# EAGLE design Tape IF frontend (EAGLE 6.5.0)
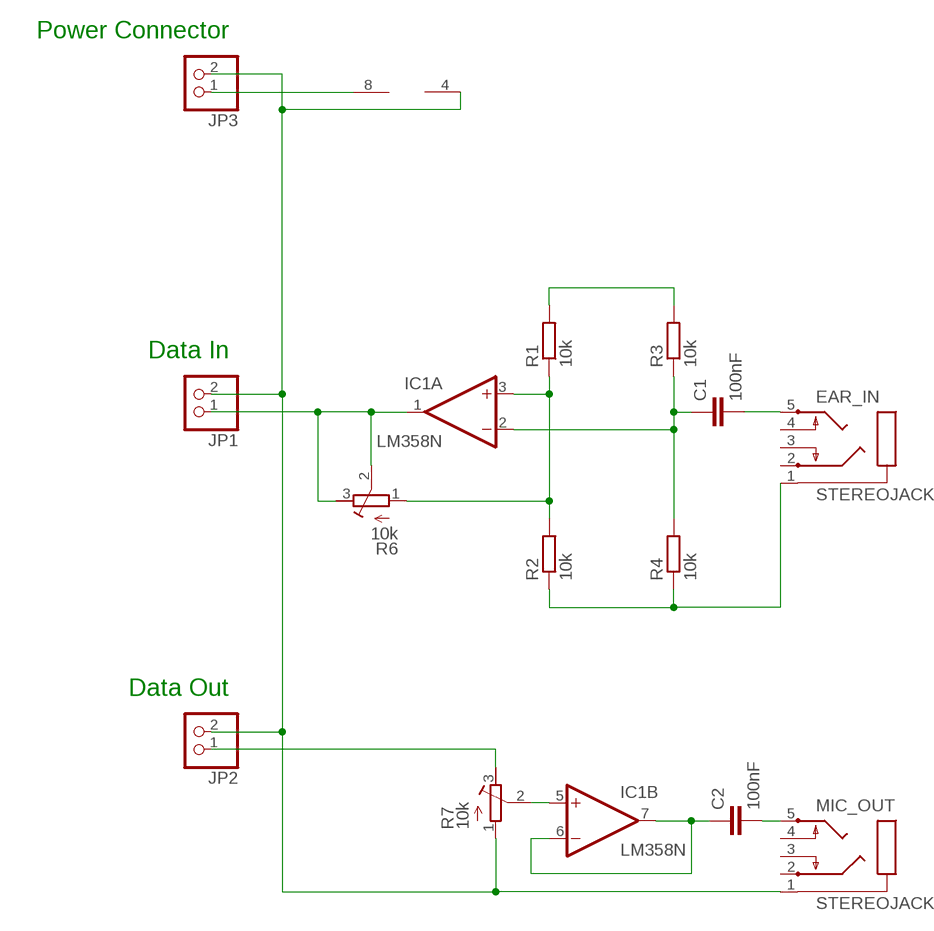
[diagram p0: schematic, sheet 1]

## Parts
C1  100nF  C-EU050-025X075  [C050-025X075]
C2  100nF  C-EU050-025X075  [C050-025X075]
EAR_IN  STEREOJACK  [STX3100]
IC1  LM358N  [DIL08]
JP1  PINHD-1X2  [1X02]
JP2  PINHD-1X2  [1X02]
JP3  PINHD-1X2  [1X02]
MIC_OUT  STEREOJACK  [STX3100]
R1  10k  R-EU_0207/10  [0207/10]
R2  10k  R-EU_0207/10  [0207/10]
R3  10k  R-EU_0207/10  [0207/10]
R4  10k  R-EU_0207/10  [0207/10]
R6  10k  R-TRIMM64W  [RTRIM64W]
R7  10k  R-TRIMM64W  [RTRIM64W]

## Nets
+5V: IC1.8(P:V+) JP3.1
BUFFERED_OUT: C2.2 MIC_OUT.5
EAR_SCHMITTED: IC1.1(A:OUT) JP1.1 R6.2(S) R6.3(E)
GND: IC1.4(P:V-) JP1.2 JP2.2 JP3.2 MIC_OUT.1 R7.1(A)
N$1: C1.2 EAR_IN.5
N$2: C1.1 IC1.2(A:-IN) R3.1 R4.2
N$3: IC1.3(A:+IN) R1.1 R2.2 R6.1(A)
N$4: EAR_IN.1 R2.1 R4.1
N$5: R1.2 R3.2
N$8: C2.1 IC1.6(B:-IN) IC1.7(B:OUT)
N$9: IC1.5(B:+IN) R7.2(S)
UNBUFFERED_OUT: JP2.1 R7.3(E)
Unconnected: EAR_IN.2 EAR_IN.3 EAR_IN.4 MIC_OUT.2 MIC_OUT.3 MIC_OUT.4

## Notes on the sheet
- Power Connector
- Data In
- Data Out

## Library data of the parts
C1 C2 = rcl:C-EU: CAPACITOR, European symbol
EAR_IN MIC_OUT = adafruit:STEREOJACK: MIC/HEADPHONE JACK Stereo jack with two switches. Kycon STX3100, CUI SJ1-3555NG and/or 4UCon 05544
IC1 = linear:LM358: OP AMP also LM158; LM258; LM2904 Source: http://cache.national.com/ds/LM/LM158.pdf
JP1-JP3 = pinhead:PINHD-1X2: PIN HEADER
R1-R4 = rcl:R-EU_: RESISTOR, European symbol
R6 R7 = rcl:R-TRIMM: Trimm resistor

## Board
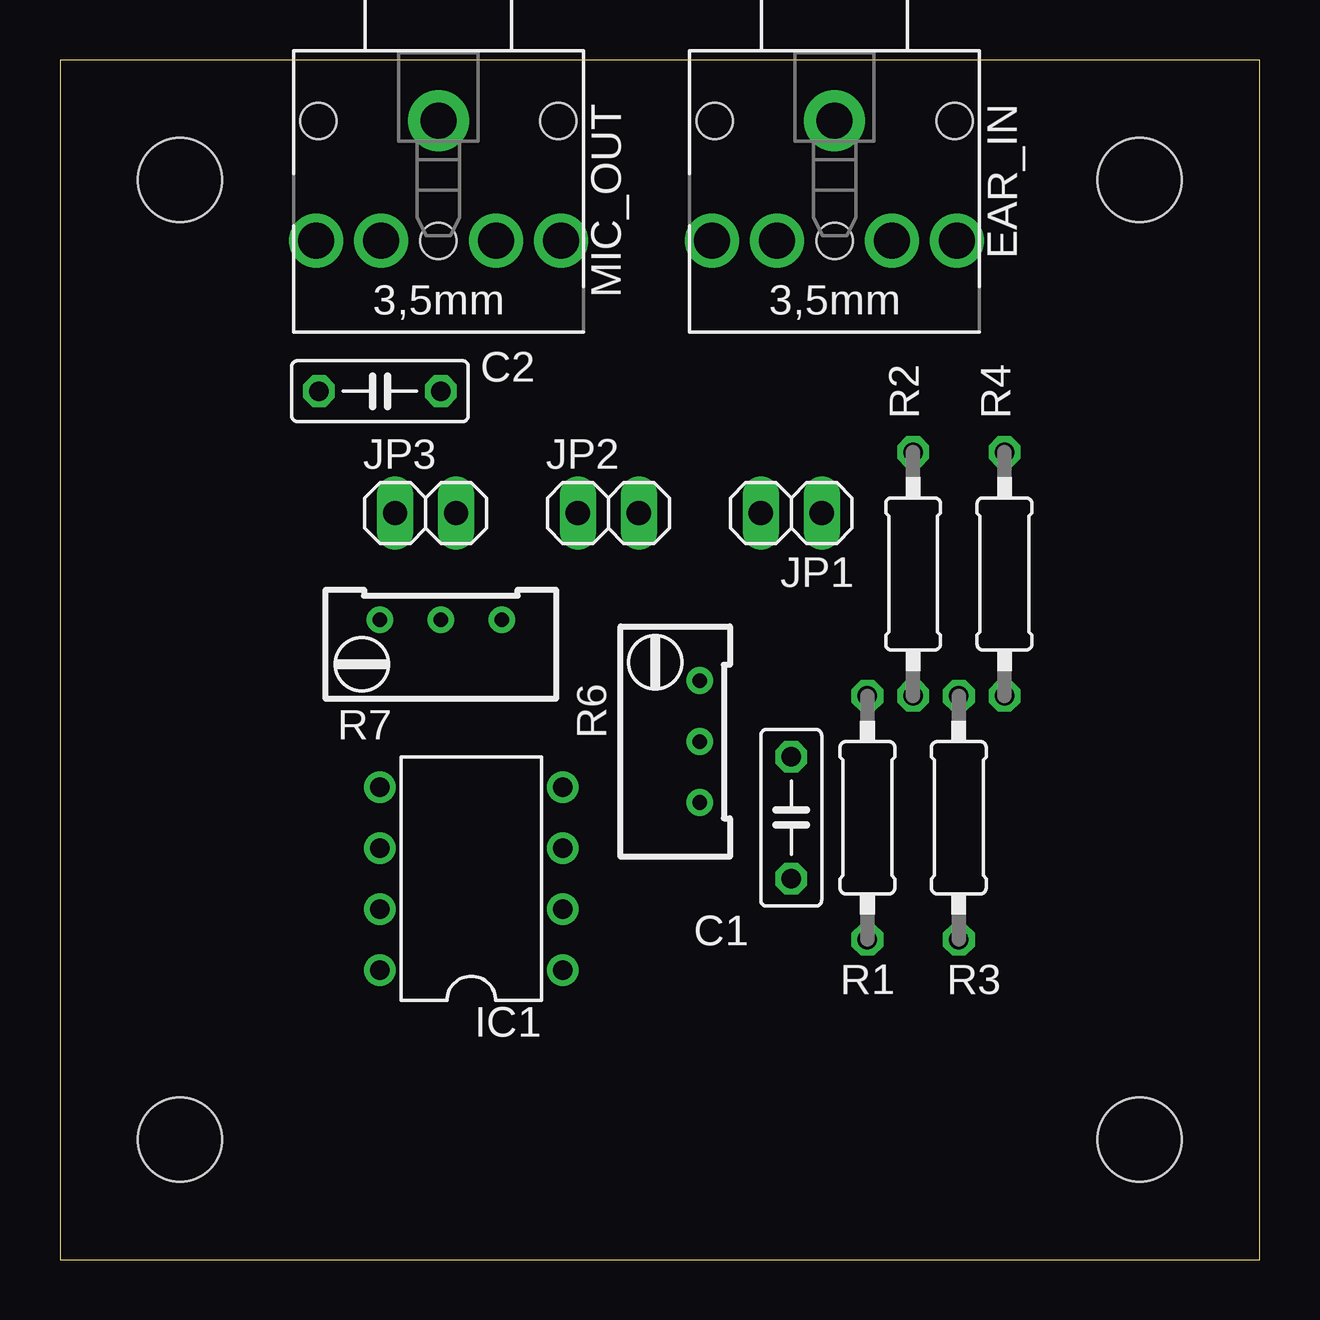
[diagram p1: board, top side]
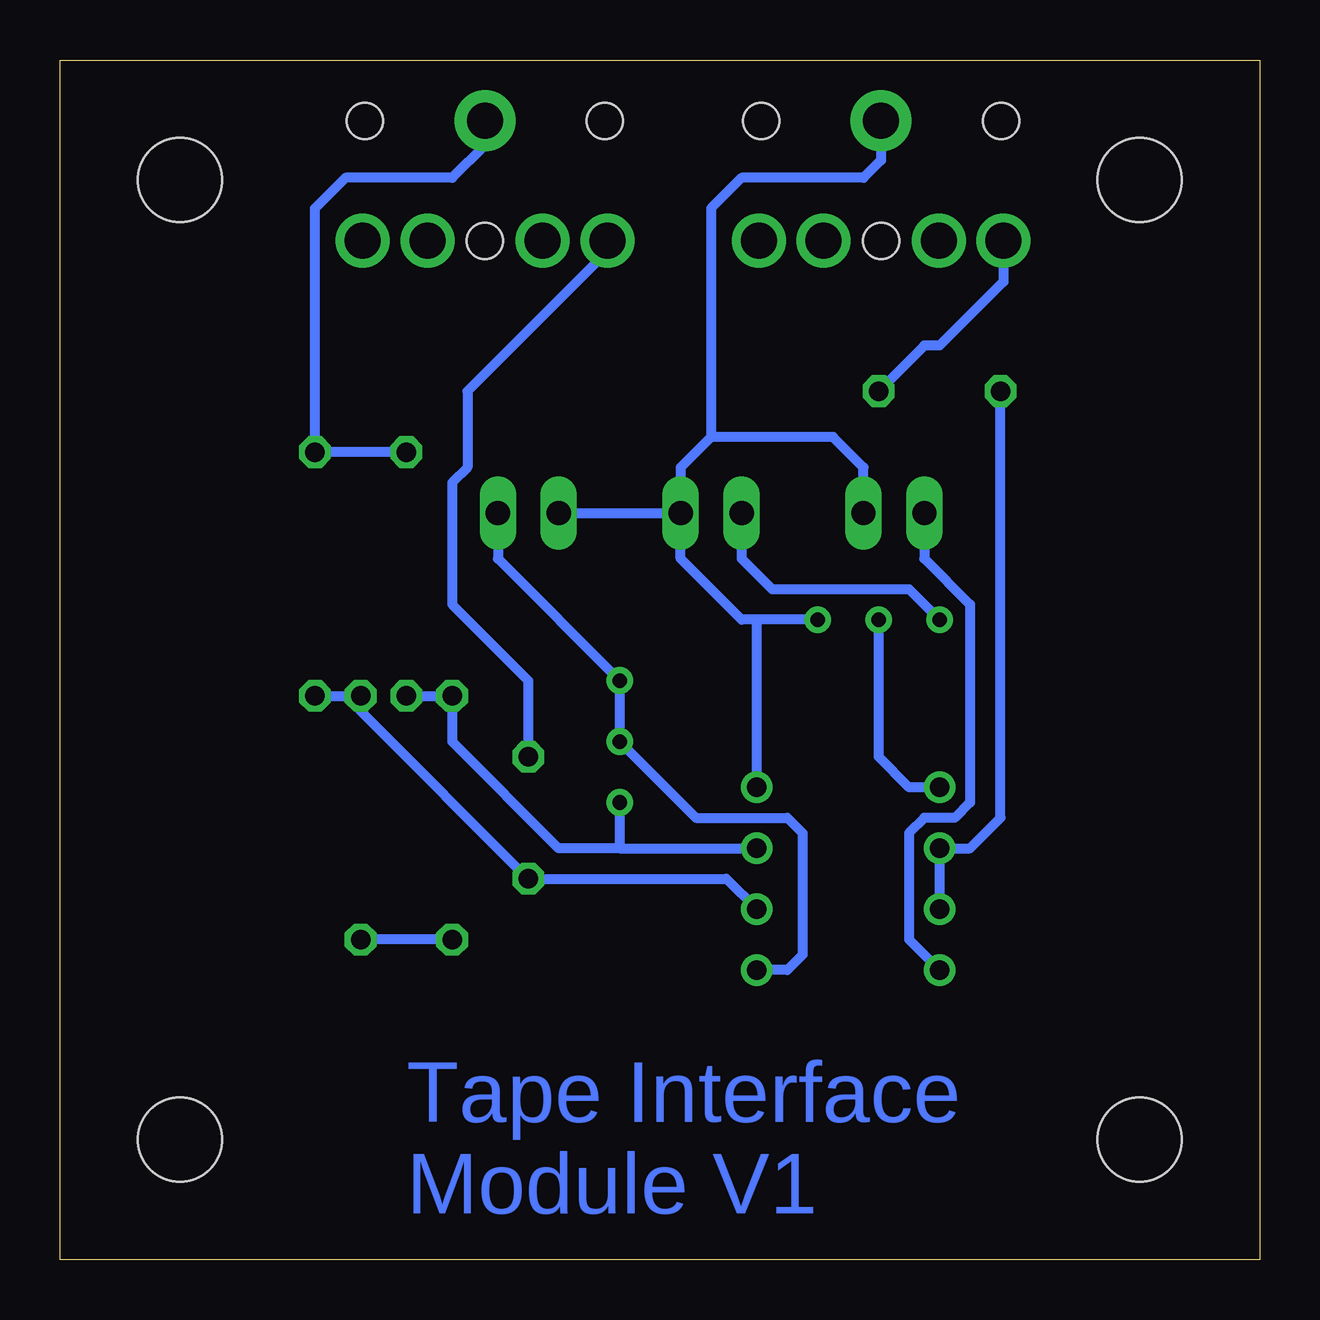
[diagram p2: board, bottom side, seen from below]

Size 50 x 50 mm. Coordinates in mm from the lower left corner, seen from the top.
Outline: 0,0 50,0 50,50 0,50 0,0
Copper layers (1*16): Top 0.035mm / dielectric 1.5mm / Bottom 0.035mm
Design rules "default": minimum track width 10mil, minimum drill 24mil, track to track 8mil, track to pad 8mil, pad to pad 8mil, via to via 8mil, smd to smd 8mil, copper to edge 40mil, drill to drill 8mil, minimum pad ring 10mil, minimum via ring 8mil, stop-mask expansion 4mil, vias tented up to drill 0mil, thermal gap 10mil
Holes 3.5 mm at 5,5 45,5 5,45 45,45

### Footprints (pad centres in the part's own frame; a part is rotated, then mirrored left to right if it is on the bottom)
C050-025X075 = drill 0.813 octagon: 1 -2.54,0; 2 2.54,0
STX3100 = drill 1.5 pad 2.54: 1 2.7,-0.1 | drill 1.5: 2 7.7,5; 3 7.7,2.3; 4 7.7,-2.5; 5 7.7,-5.2 | hole 1.5: 2.7,4.9; 2.7,-5.1; 7.7,-0.1
DIL08 = drill 0.813 pad 1.27: 1 -3.81,-3.81; 2 -1.27,-3.81; 3 1.27,-3.81; 4 3.81,-3.81; 5 3.81,3.81; 6 1.27,3.81; 7 -1.27,3.81; 8 -3.81,3.81
1X02 = drill 1.016 long: 1 -1.27,0; 2 1.27,0
0207/10 = drill 0.813 octagon: 1 -5.08,0; 2 5.08,0
RTRIM64W = drill 0.61: 1 1.27,-2.54; 2 1.27,0; 3 1.27,2.54

### Placement (x,y rotation side)
C1  30.48,18.41 90 top
C2  13.34,36.2 0 top
EAR_IN  32.38,50.16 270 top
IC1  17.14,15.88 90 top
JP1  30.48,31.11 180 top
JP2  22.86,31.11 0 top
JP3  15.24,31.11 0 top
MIC_OUT  15.88,50.16 270 top
R1  33.66,18.41 270 top
R2  35.56,28.57 270 top
R3  37.47,18.41 270 top
R4  39.37,28.57 270 top
R6  25.4,21.59 0 top
R7  15.88,25.4 90 top

### Tracks (layer width: path | path; a pad name or v marks a point on that pad's centre or on a via)
+5V
  Bottom 0.406: JP3.1 13.97,29.21 12.06,27.3 12.06,19.05 12.7,18.41 13.97,18.41 14.61,17.78 14.61,13.34 IC1.8
BUFFERED_OUT
  Bottom 0.406: MIC_OUT.5 10.68,40.76 13.34,38.1 13.97,38.1 C2.2
EAR_SCHMITTED
  Bottom 0.406: JP1.1 31.75,29.21 R6.3 R6.2 23.5,18.41 19.68,18.41 19.05,17.78 19.05,12.7 19.68,12.06 IC1.1
GND
  Bottom 0.406: JP1.2 JP2.2 | R7.1 20.95,26.67 | 20.95,26.67 21.59,26.67 24.13,29.21 JP2.2 | IC1.4 20.95,26.67 | JP3.2 16.51,33.02 17.78,34.29 22.86,34.29 | 22.86,34.29 24.13,33.02 JP2.2 | MIC_OUT.1 15.78,45.82 16.51,45.09 21.59,45.09 22.86,43.81 22.86,34.29
N$1
  Bottom 0.406: EAR_IN.5 27.18,42.03 33.02,36.2 33.02,33.02 33.66,32.38 33.66,27.3 30.48,24.13 C1.2
N$2
  Bottom 0.406: IC1.2 22.23,15.88 C1.1 37.47,22.86 R3.1 R4.2
N$3
  Bottom 0.406: R2.2 R1.1 33.66,21.59 29.21,17.14 26.67,17.14 | R6.1 26.67,17.14 | 26.67,17.14 IC1.3
N$4
  Bottom 0.406: EAR_IN.1 32.28,46.45 33.66,45.09 38.1,45.09 39.37,43.81 R4.1 R2.1
N$5
  Bottom 0.406: R1.2 R3.2
N$8
  Bottom 0.406: IC1.7 IC1.6 12.06,17.14 10.79,18.41 C2.1
N$9
  Bottom 0.406: IC1.5 14.61,19.68 15.88,20.95 R7.2
UNBUFFERED_OUT
  Bottom 0.406: JP2.1 21.59,29.21 20.32,27.94 14.61,27.94 R7.3

### Text on the board
Bottom: Tape Interface / Module V1